# EAGLE schematic stromlauf (EAGLE 9.5.0)
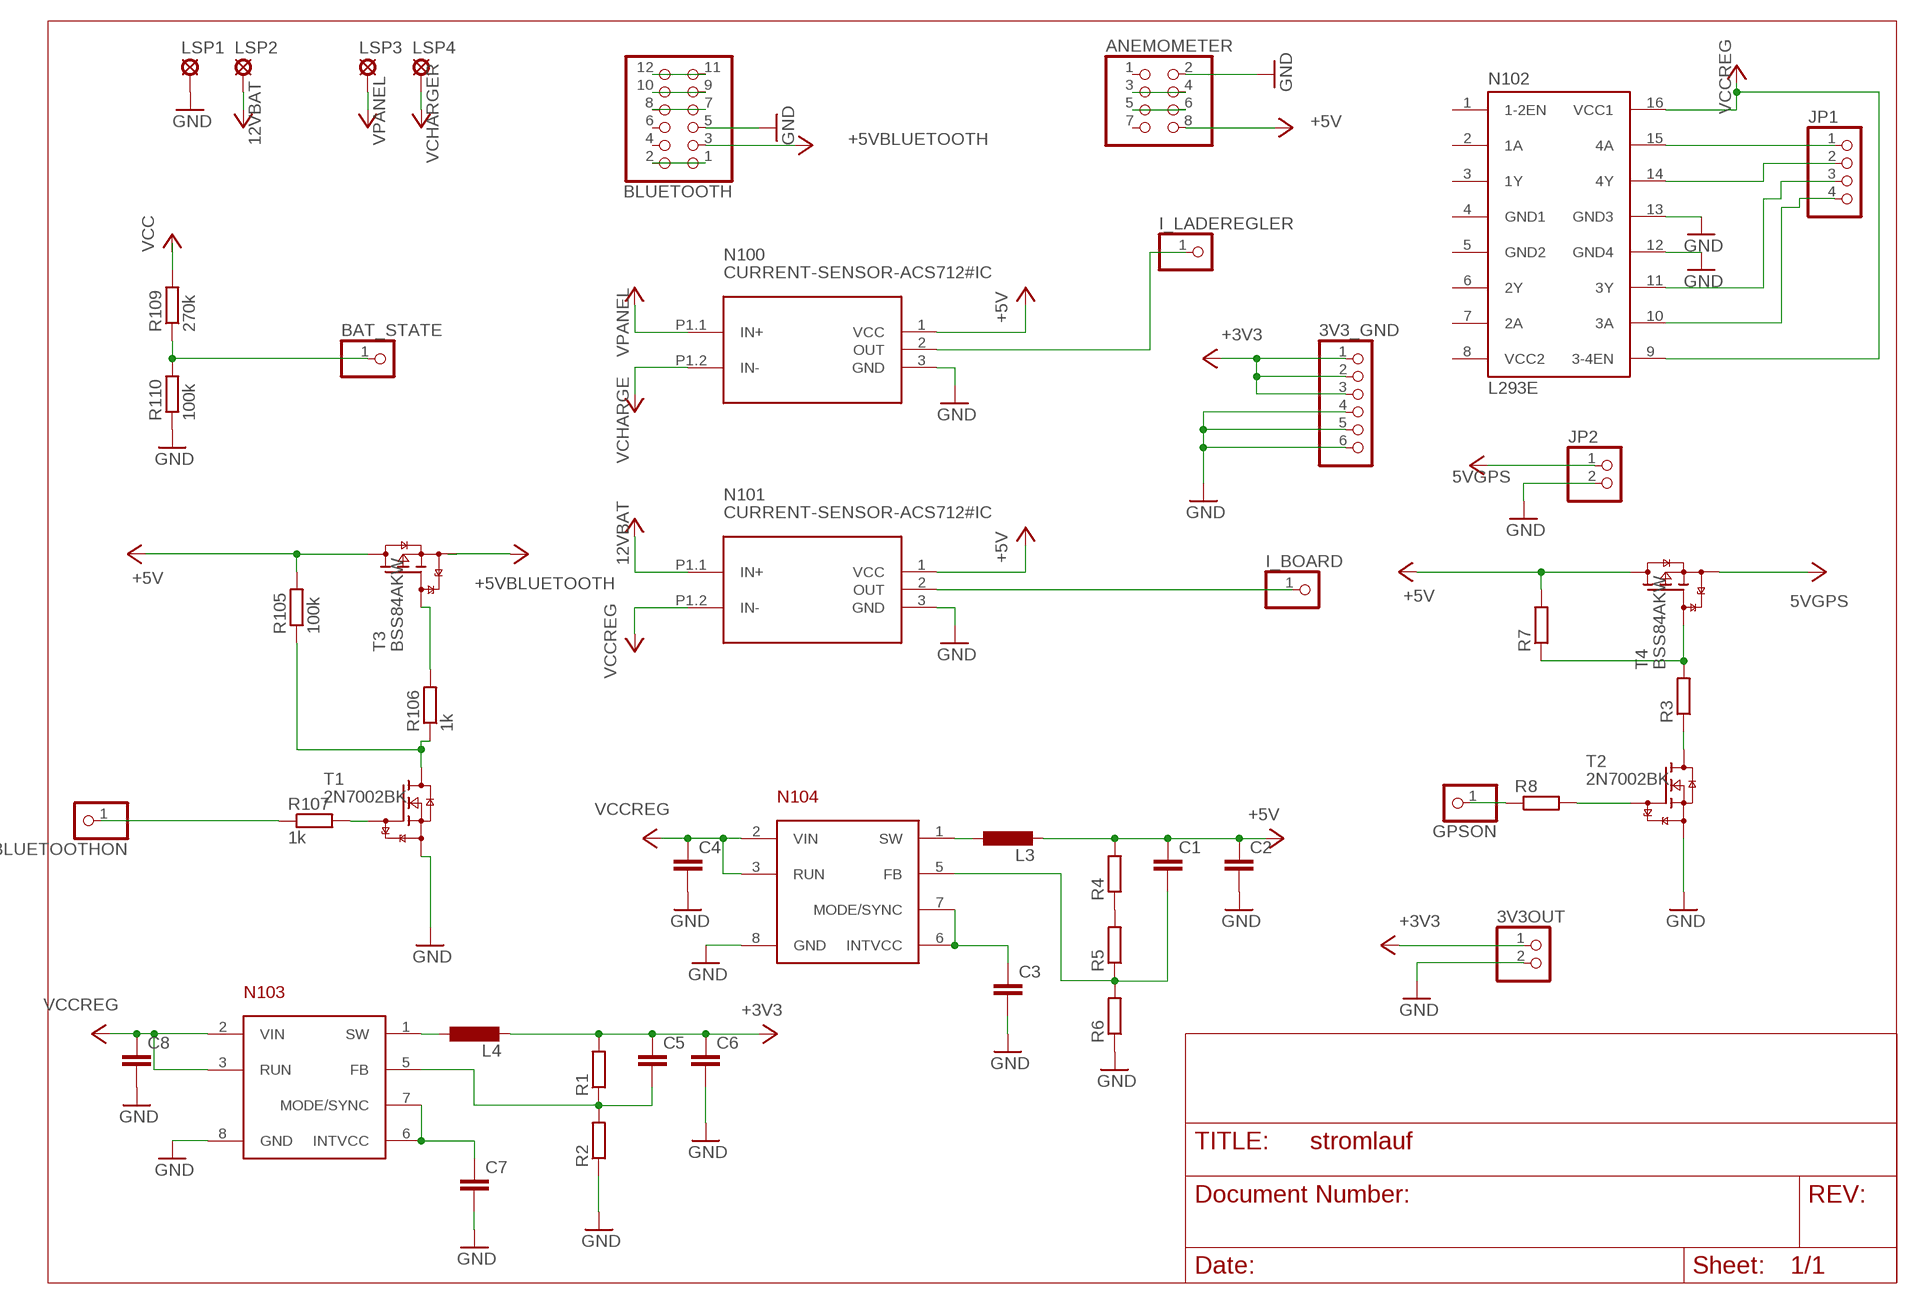
[diagram p0: schematic, sheet 1]

## Parts
3V3_GND  PINHD-1X6  [1X06]
3V3OUT  PINHD-1X2  [1X02]
ANEMOMETER  PINHD-2X4  [2X04]
BAT_STATE  PINHD-1X1  [1X01]
BLUETOOTH  PINHD-2X6  [2X06]
BLUETOOTHON  PINHD-1X1  [1X01]
C1  C-EUC0603  [C0603]
C2  C-EUC0603  [C0603]
C3  C-EUC0603  [C0603]
C4  C-EUC0603  [C0603]
C5  C-EUC0603  [C0603]
C6  C-EUC0603  [C0603]
C7  C-EUC0603  [C0603]
C8  C-EUC0603  [C0603]
GPSON  PINHD-1X1  [1X01]
I_BOARD  PINHD-1X1  [1X01]
I_LADEREGLER  PINHD-1X1  [1X01]
JP1  PINHD-1X4  [1X04]
JP2  PINHD-1X2  [1X02]
L3  L-EU0207/5V  [0207/5V]
L4  L-EU0207/5V  [0207/5V]
LSP1  SE14  [SE14]
LSP2  SE14  [SE14]
LSP3  SE14  [SE14]
LSP4  SE14  [SE14]
N100  CURRENT-SENSOR-ACS712#IC  [CURRENT-SENSOR-ACS712#IC]
N101  CURRENT-SENSOR-ACS712#IC  [CURRENT-SENSOR-ACS712#IC]
N102  L293E  [DIL16]
N103  LTC3621  [LTC3621FP]
N104  LTC3621  [LTC3621FP]
R1  R-EU_R0603  [R0603]
R2  R-EU_R0603  [R0603]
R3  R-EU_R0603  [R0603]
R4  R-EU_R0603  [R0603]
R5  R-EU_R0603  [R0603]
R6  R-EU_R0603  [R0603]
R7  R-EU_R0603  [R0603]
R8  R-EU_R0603  [R0603]
R105  100k  R-EU_R0603  [R0603]
R106  1k  R-EU_R0603  [R0603]
R107  1k  R-EU_R0603  [R0603]
R109  270k  R-EU_R0603  [R0603]
R110  100k  R-EU_R0603  [R0603]
T1  2N7002BK  [SOT23]
T2  2N7002BK  [SOT23]
T3  BSS84AKW  [SOT323]
T4  BSS84AKW  [SOT323]

## Nets
5VGPS: JP2.1 T4.2(S) ; supply symbol labelled VCC
12VBAT: LSP2.MP N101.P1.1(IN+) R109.2 ; supply symbol labelled VCC
+3V3: 3V3_GND.1 3V3_GND.2 3V3_GND.3 3V3OUT.1 C5.1 C6.1 L4.2 R1.2 ; supply symbol labelled VCC
+5V: ANEMOMETER.8 C1.1 C2.1 L3.2 N100.1(VCC) N101.1(VCC) R4.2 R7.2 R105.2 T3.3(D) T4.3(D) ; supply symbol labelled VCC
+5VBLUETOOTH: BLUETOOTH.3 T3.2(S) ; supply symbol labelled +5V
BLUETOOTH_ON: BLUETOOTHON.1 R107.1
GND: 3V3_GND.4 3V3_GND.5 3V3_GND.6 3V3OUT.2 ANEMOMETER.2 BLUETOOTH.5 C2.2 C3.2 C4.2 C6.2 C7.2 C8.2 JP2.2 LSP1.MP N100.3(GND) N101.3(GND) N102.12(GND4) N102.13(GND3) N103.8(GND) N104.8(GND) R2.1 R6.1 R110.1 T1.2(S) T2.2(S)
N$1: R106.2 T3.1(G)
N$2: C7.1 N103.6(INTVCC) N103.7(MODE/SYNC)
N$3: R107.2 T1.1(G)
N$4: R105.1 R106.1 T1.3(D)
N$5: L4.1 N103.1(SW)
N$6: JP1.1 N102.15(4A)
N$7: JP1.2 N102.14(4Y)
N$8: JP1.3 N102.11(3Y)
N$9: JP1.4 N102.10(3A)
N$10: L3.1 N104.1(SW)
N$11: C5.2 N103.5(FB) R1.1 R2.2
N$12: C3.1 N104.6(INTVCC) N104.7(MODE/SYNC)
N$13: R4.1 R5.2
N$14: C1.2 N104.5(FB) R5.1 R6.2
N$15: I_LADEREGLER.1 N100.2(OUT)
N$16: I_BOARD.1 N101.2(OUT)
N$17: BAT_STATE.1 R109.1 R110.2
N$18: R8.2 T2.1(G)
N$19: R3.1 T2.3(D)
N$20: R3.2 R7.1 T4.1(G)
N$21: GPSON.1 R8.1
N$22: BLUETOOTH.1 BLUETOOTH.2
N$23: BLUETOOTH.11 BLUETOOTH.12
N$24: BLUETOOTH.9 BLUETOOTH.10
N$25: BLUETOOTH.7 BLUETOOTH.8
N$26: ANEMOMETER.3 ANEMOMETER.4
N$27: ANEMOMETER.5 ANEMOMETER.6
VCCREG: C4.1 C8.1 N101.P1.2(IN-) N102.9(3-4EN) N102.16(VCC1) N103.2(VIN) N103.3(RUN) N104.2(VIN) N104.3(RUN) ; supply symbol labelled VCC
VCHARGE: N100.P1.2(IN-) ; supply symbol labelled VCC
VCHARGER: LSP4.MP ; supply symbol labelled VCC
VPANEL: LSP3.MP N100.P1.1(IN+) ; supply symbol labelled VCC
Unconnected: ANEMOMETER.1 ANEMOMETER.7 BLUETOOTH.4 BLUETOOTH.6 N102.1(1-2EN) N102.2(1A) N102.3(1Y) N102.6(2Y) N102.7(2A)

## Power pins joined to a net without a drawn wire
GND1: N102.4(GND1)
GND2: N102.5(GND2)
VCC2: N102.8(VCC2)

## Library data of the parts
3V3_GND = pinhead:PINHD-1X6: PIN HEADER
3V3OUT JP2 = pinhead:PINHD-1X2: PIN HEADER
ANEMOMETER = pinhead:PINHD-2X4: PIN HEADER
BAT_STATE BLUETOOTHON GPSON I_BOARD I_LADEREGLER = pinhead:PINHD-1X1: PIN HEADER
BLUETOOTH = pinhead:PINHD-2X6: PIN HEADER
C1-C8 = rcl:C-EU: CAPACITOR, European symbol; SPICEPREFIX: C
JP1 = pinhead:PINHD-1X4: PIN HEADER
L3 L4 = rcl:L-EU: INDUCTOR, European symbol; SPICEPREFIX: L
LSP1-LSP4 = solpad:SE14: SOLDER PAD E1553, drill 1,4mm, distributor Buerklin, 07F820
N100 N101 = diy-modules:CURRENT-SENSOR-ACS712#IC: Isolated Bipolar Current Sensors based on ACS712 chip Symbol with input pins More details available here: http://embedded-lab.com/blog/a-brief-overview-of-allegro-acs712-current-sensor-part-1/ Click here to find device on ebay.com <http://www.ebay.com/sch/acs712+module> Note: There are many available versions with different pinout. Please check before use
N102 = texas:L293E: TI DEVICE; MF: Arrow Electronics; MPN: L293E; OC_FARNELL: 1467711; OC_NEWARK: 89K0732
N103 N104 = SOP65P490X110-8N:LTC3621
R1-R8 R105-R107 R109 R110 = rcl:R-EU_: RESISTOR, European symbol; SPICEPREFIX: R
T1 T2 = nxp_60:2N7002B: 60 V, single N-channel Trench MOSFET N-channel enhancement mode Field-Effect Transistor (FET) in a leadless ultra small DFN1006B-3 (SOT883B) Surface-Mounted Device (SMD) plastic package using Trench MOSFET technology. AAL Eindhoven MK
T3 T4 = nxp_60:BSS84A: 50 V, 150 mA P-channel Trench MOSFET P-channel enhancement mode Field-Effect Transistor (FET) in a small Surface-Mounted Device (SMD) plastic package using Trench MOSFET technology. AAL Eindhoven MK